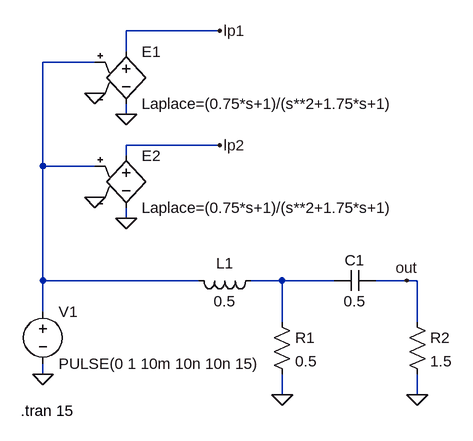
[diagram p0: schematic RCL_rt.asc]
RCL_rt.asc, the LTspice schematic file:
Version 4
SHEET 1 880 680
WIRE 432 -112 288 -112
WIRE 288 -80 288 -112
WIRE 240 -64 160 -64
WIRE 288 16 288 0
WIRE 432 64 288 64
WIRE 288 80 288 64
WIRE 160 96 160 -64
WIRE 240 96 160 96
WIRE 288 176 288 160
WIRE 160 272 160 96
WIRE 400 272 160 272
WIRE 528 272 480 272
WIRE 608 272 528 272
WIRE 720 272 672 272
WIRE 736 272 720 272
WIRE 160 320 160 272
WIRE 528 336 528 272
WIRE 736 336 736 272
WIRE 160 416 160 400
WIRE 528 448 528 416
WIRE 736 448 736 416
FLAG 288 176 0
FLAG 288 16 0
FLAG 240 -16 0
FLAG 240 144 0
FLAG 528 448 0
FLAG 736 448 0
FLAG 432 -112 lp1
FLAG 432 64 lp2
FLAG 720 272 out
FLAG 160 416 0
SYMBOL e 288 -96 R0
SYMATTR InstName E1
SYMATTR Value Laplace=(0.75*s+1)/(s**2+1.75*s+1)
SYMBOL e 288 64 R0
SYMATTR InstName E2
SYMATTR Value Laplace=(0.75*s+1)/(s**2+1.75*s+1)
SYMBOL ind 496 256 R90
WINDOW 0 5 56 VBottom 2
WINDOW 3 32 56 VTop 2
SYMATTR InstName L1
SYMATTR Value 0.5
SYMBOL res 512 320 R0
SYMATTR InstName R1
SYMATTR Value 0.5
SYMBOL res 720 320 R0
SYMATTR InstName R2
SYMATTR Value 1.5
SYMBOL cap 672 256 R90
WINDOW 0 0 32 VBottom 2
WINDOW 3 32 32 VTop 2
SYMATTR InstName C1
SYMATTR Value 0.5
SYMBOL voltage 160 304 R0
WINDOW 123 0 0 Left 2
WINDOW 39 0 0 Left 2
SYMATTR InstName V1
SYMATTR Value PULSE(0 1 10m 10n 10n 15)
TEXT 126 472 Left 2 !.tran 15

The netlist it stands for:
* RCL_rt.asc
E1 lp1 0 N001 0 Laplace=(0.75*s+1)/(s**2+1.75*s+1)
E2 lp2 0 N001 0 Laplace=(0.75*s+1)/(s**2+1.75*s+1)
L1 N002 N001 0.5
R1 N002 0 0.5
R2 out 0 1.5
C1 out N002 0.5
V1 N001 0 PULSE(0 1 10m 10n 10n 15)
.tran 15
.backanno
.end